# EAGLE design tdlf_03_05_2021_server (EAGLE 9.6.2)
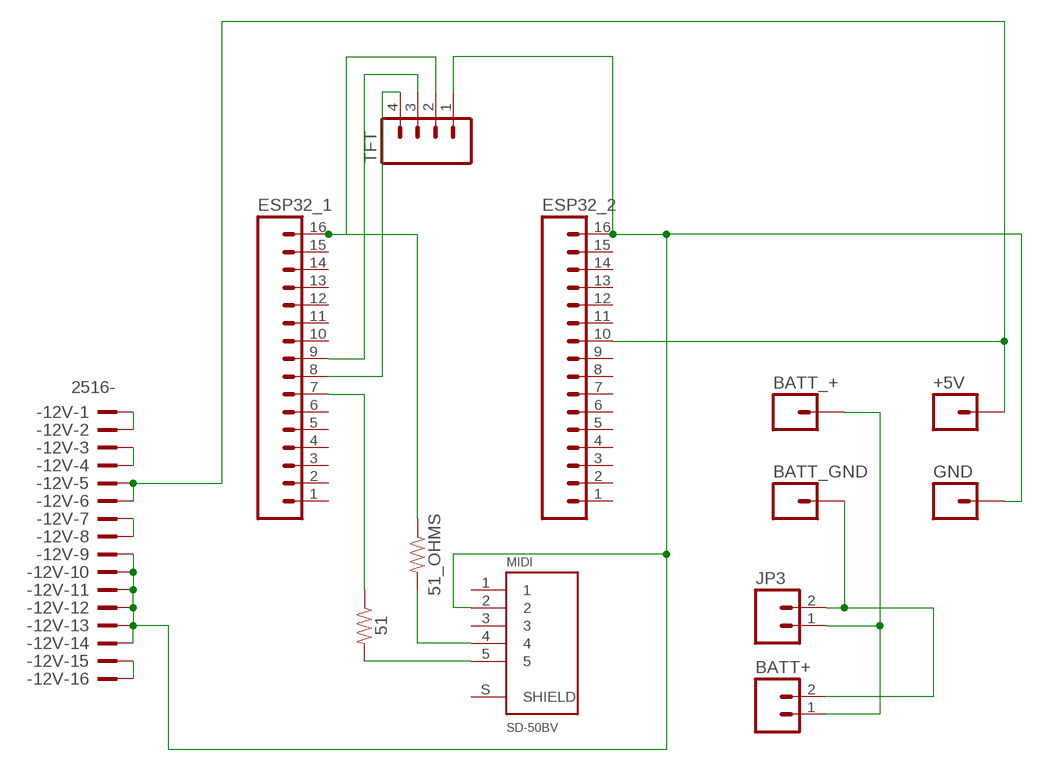
[diagram p0: schematic, sheet 1]

## Parts
51  RESISTOR1206  [1206]
51_OHMS  RESISTOR1206  [1206]
+5V  M01PTH  [1X01]
-12V  2516-  [PAK100/2500-16]
BATT+  M02PTH  [1X02]
BATT_+  M01PTH  [1X01]
BATT_GND  M01PTH  [1X01]
ESP32_1  M16PTH  [1X16]
ESP32_2  M16PTH  [1X16]
GND  M01PTH  [1X01]
JP3  M02PTH  [1X02]
MIDI  SD-50BV  [CUI_SD-50BV]
TFT  M04PTH  [1X04]

## Nets
3V: 51_OHMS.2 MIDI.4
3V3: 51_OHMS.1 ESP32_1.16 TFT.2
5V: +5V.1 -12V.5 -12V.6 ESP32_2.10
+12V: -12V.7 -12V.8
+VBATT: BATT+.2 BATT_GND.1 JP3.2
-12V: -12V.15 -12V.16
GND: -12V.9 -12V.10 -12V.11 -12V.12 -12V.13 -12V.14 ESP32_2.16 GND.1 MIDI.2 TFT.1
GND_BATT: BATT+.1 BATT_+.1 JP3.1
N$1: ESP32_1.9 TFT.3
N$2: ESP32_1.8 TFT.4
N$4: 51.1 ESP32_1.7
N$6: -12V.1 -12V.2
N$7: -12V.3 -12V.4
PIN27: 51.2 MIDI.5
Unconnected: ESP32_1.1 ESP32_1.2 ESP32_1.3 ESP32_1.4 ESP32_1.5 ESP32_1.6 ESP32_1.10 ESP32_1.11 ESP32_1.12 ESP32_1.13 ESP32_1.14 ESP32_1.15 ESP32_2.1 ESP32_2.2 ESP32_2.3 ESP32_2.4 ESP32_2.5 ESP32_2.6 ESP32_2.7 ESP32_2.8 ESP32_2.9 ESP32_2.11 ESP32_2.12 ESP32_2.13 ESP32_2.14 ESP32_2.15 MIDI.1 MIDI.3 MIDI.S(SHIELD)

## Library data of the parts
51 51_OHMS = SparkFun-Resistors:RESISTOR: Generic Resistor Package
+5V BATT_+ BATT_GND GND = SparkFun-Connectors:M01: Header 1 Standard 1-pin 0.1" header. Use with straight break away headers (SKU : PRT-00116), right angle break away headers (PRT-00553), swiss pins (PRT-00743), machine pins (PRT-00117), and female headers (PRT-00115).
-12V = con-3m:2516-: 3M (TM) Pak 100 4-Wall Header Source: 3M; OC_FARNELL: unknown; OC_NEWARK: unknown
BATT+ JP3 = SparkFun-Connectors:M02: Standard 2-pin 0.1" header. Use with - straight break away headers ( PRT-00116) - right angle break away headers (PRT-00553) - swiss pins (PRT-00743) - machine pins (PRT-00117) - female headers (PRT-00115) Molex polarized connector foot print use with: PRT-08233 with associated crimp pins and housings. 2.54_SCREWTERM for use with PRT-10571. 3.5mm Screw Terminal footprints for PRT-08084 5mm Screw Terminal footprints for use with PRT-08432
ESP32_1 ESP32_2 = SparkFun-Connectors:M16: 1x16 .1" header
MIDI = SD-50BV:SD-50BV: 5 Positions, Receptacle, Vertical, Through Hole, Shielded, Standard Circular DIN Connector; MF: CUI Inc; PARTREV: 1.03; STANDARD: Manufacturer recommendations
TFT = SparkFun-Connectors:M04: Header 4 Standard 4-pin 0.1" header. Use with straight break away headers (SKU : PRT-00116), right angle break away headers (PRT-00553), swiss pins (PRT-00743), machine pins (PRT-00117), and female headers (PRT-00115). Molex polarized connector foot print use with SKU : PRT-08231 with associated crimp pins and housings. 1MM SMD Version SKU: PRT-10208

## Board
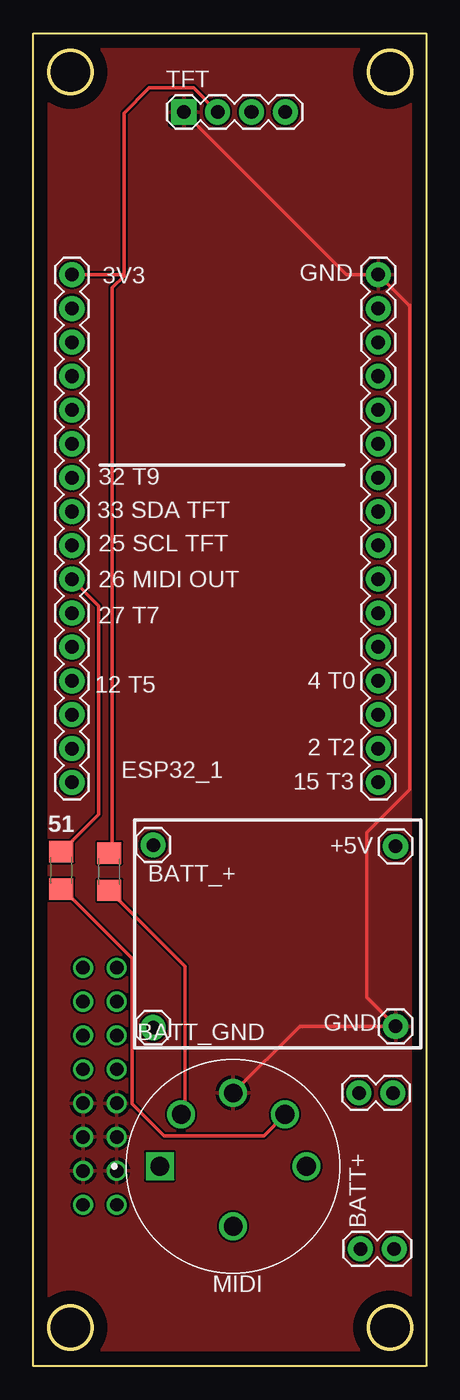
[diagram p1: board, top side]
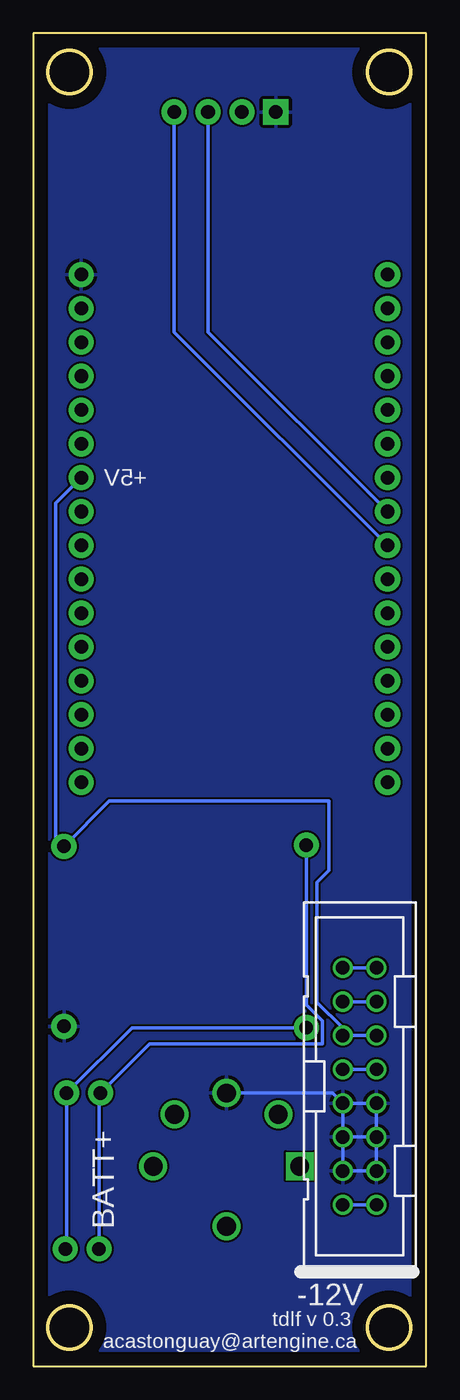
[diagram p2: board, bottom side, seen from below]

Size 29.5 x 100 mm. Coordinates in mm from the lower left corner, seen from the top.
Outline: 0,0 0,100 29.5,100 29.5,0 0,0
Outline: circle at 26.8,97.1 radius 1.62
Outline: circle at 2.8,97.1 radius 1.62
Outline: circle at 2.8,2.9 radius 1.62
Outline: circle at 26.8,2.9 radius 1.62
Copper layers (1*16): Top 0.035mm / dielectric 1.5mm / Bottom 0.035mm
Design rules "default": minimum track width 6mil, minimum drill 0.35mm, track to track 6mil, track to pad 6mil, pad to pad 6mil, via to via 6mil, smd to smd 6mil, copper to edge 40mil, drill to drill 6mil, minimum pad ring 10mil, minimum via ring 8mil, stop-mask expansion 4mil, vias tented up to drill 0mil, thermal gap 10mil

### Footprints (pad centres in the part's own frame; a part is rotated, then mirrored left to right if it is on the bottom)
1206 = smd 1.6 x 1.8: 1 -1.4,0; 2 1.4,0
1X01 = drill 1.016 pad 1.88: 1 0,0
PAK100/2500-16 = drill 1 pad 1.422: 1 -8.89,-1.27; 2 -8.89,1.27; 3 -6.35,-1.27; 4 -6.35,1.27; 5 -3.81,-1.27; 6 -3.81,1.27; 7 -1.27,-1.27; 8 -1.27,1.27; 9 1.27,-1.27; 10 1.27,1.27; 11 3.81,-1.27; 12 3.81,1.27; 13 6.35,-1.27; 14 6.35,1.27; 15 8.89,-1.27; 16 8.89,1.27
1X02 = drill 1.016 pad 1.88: 1 0,0; 2 2.54,0
1X16 = drill 1.016 pad 1.88: 1 0,0; 2 2.54,0; 3 5.08,0; 4 7.62,0; 5 10.16,0; 6 12.7,0; 7 15.24,0; 8 17.78,0; 9 20.32,0; 10 22.86,0; 11 25.4,0; 12 27.94,0; 13 30.48,0; 14 33.02,0; 15 35.56,0; 16 38.1,0
CUI_SD-50BV = drill 1.4 square: 1 0,-5.5 | drill 1.4: 2 -5.5,0; 3 0,5.5; 4 -3.89,-3.89; 5 -3.89,3.89; S 4.5,0
1X04 = drill 1.016 pad 1.88 square: 1 0,0 | drill 1.016 pad 1.88: 2 2.54,0; 3 5.08,0; 4 7.62,0

### Placement (x,y rotation side)
51  2.1,37.2 270 top
51_OHMS  5.7,37.1 270 top
+5V  27.2,39 0 top
-12V  5,21 270 bottom
BATT+  27.1,8.8 180 top
BATT_+  9,25.4 0 top
BATT_GND  9,39.1 0 top
ESP32_1  2.9,43.8 90 top
ESP32_2  25.9,43.8 90 top
GND  27.2,25.5 0 top
JP3  27,20.5 180 top
MIDI  15,15 270 top
TFT  11.3,94.1 0 top

### Tracks (layer width: path | path; a pad name or v marks a point on that pad's centre or on a via)
3V
  Top 0.254: 51_OHMS.2 11.4,30 11.4,19.18 MIDI.4
3V3
  Top 0.254: 6.8,81.88 6.8,81.8 5.9,80.9 5.9,38.7 51_OHMS.1 | 3.1,81.9 6.78,81.9 6.8,81.88 | 3.1,81.9 ESP32_1.16 | 2.92,82.08 3.1,81.9 | TFT.2 12.04,95.9 8.7,95.9 6.8,94 6.8,81.88
5V
  Bottom 0.254: -12V.6 -12V.5 6.27,25.37 8.2,27.3 8.2,36.3 7.3,37.2 7.3,42.4 23.8,42.4 +5V.1 27.8,39.6 27.8,64.76 ESP32_2.10
+12V
  Bottom 0.254: -12V.8 -12V.7
+VBATT
  Bottom 0.254: BATT+.2 24.56,20.4 JP3.2 20.78,24.18 8.49,24.18 8.48,24.2 7.8,24.2 7.8,24.88 7.78,24.89 7.78,25.91 9,27.12 BATT_GND.1
-12V
  Bottom 0.254: -12V.16 -12V.15
GND
  Top 0.254: 28.28,79.62 28.28,79.52 | 28.28,79.52 28.28,43.28 25.04,40.04 25.04,27.66 GND.1 20,25.5 MIDI.2 15,20.7 | 28.28,79.52 ESP32_2.16 25.9,81.8 26,81.9 23.5,81.9 TFT.1
  Bottom 0.254: -12V.12 -12V.11 | -12V.12 -12V.14 -12V.13 -12V.11 | -12V.12 -12V.10 -12V.9 | -12V.11 -12V.9 | -12V.9 7.04,20.5 MIDI.2
  pour Bottom: 29,99.8 29.4,99.8 29.4,1 29.5,0.3 0.7,0.3 0.3,0.5 0.2,99.8
  pour Top: 0.5,99.7 29.29,99.7 29.29,0.3 0.3,0.3 0.3,99.7 0.5,99.9
GND_BATT
  Bottom 0.254: BATT+.1 27,8.9 JP3.1 22.1,25.4 BATT_+.1
N$1
  Bottom 0.254: TFT.3 16.38,77.6 ESP32_1.9
N$2
  Bottom 0.254: TFT.4 18.92,77.6 ESP32_1.8
N$4
  Top 0.254: ESP32_1.7 4.9,57.04 4.9,41.4 51.1
N$6
  Bottom 0.254: -12V.2 -12V.1
N$7
  Bottom 0.254: -12V.4 -12V.3
PIN27
  Top 0.254: 2.2,35.9 51.2 2.2,35.8 7.4,30.6 7.4,19.7 9.8,17.3 17.3,17.3 MIDI.5

### Text on the board
tPlace: 3V3
tNames: GND | 32 T9 | 33 SDA TFT | 25 SCL TFT | 26 MIDI OUT | 27 T7 | 4 T0 | 12 T5 | 2 T2 | 15 T3
bNames: +5V | BATT+ | tdlf v 0.3 / acastonguay@artengine.ca